# Altium schematic sheet PWR_MCU.SchDoc
size 420 x 297 mm; Address1: Address1; Address2: Address2; Address3: Address3; Address4: Address4; DocumentNumber: АБВГ.123456.001 Э3; SheetNumber: 1; SheetTotal: 3; Scale: 1:1; DocumentType: Схема электрическая принципиальная; FirstReferrence: АБВГ.123456.001
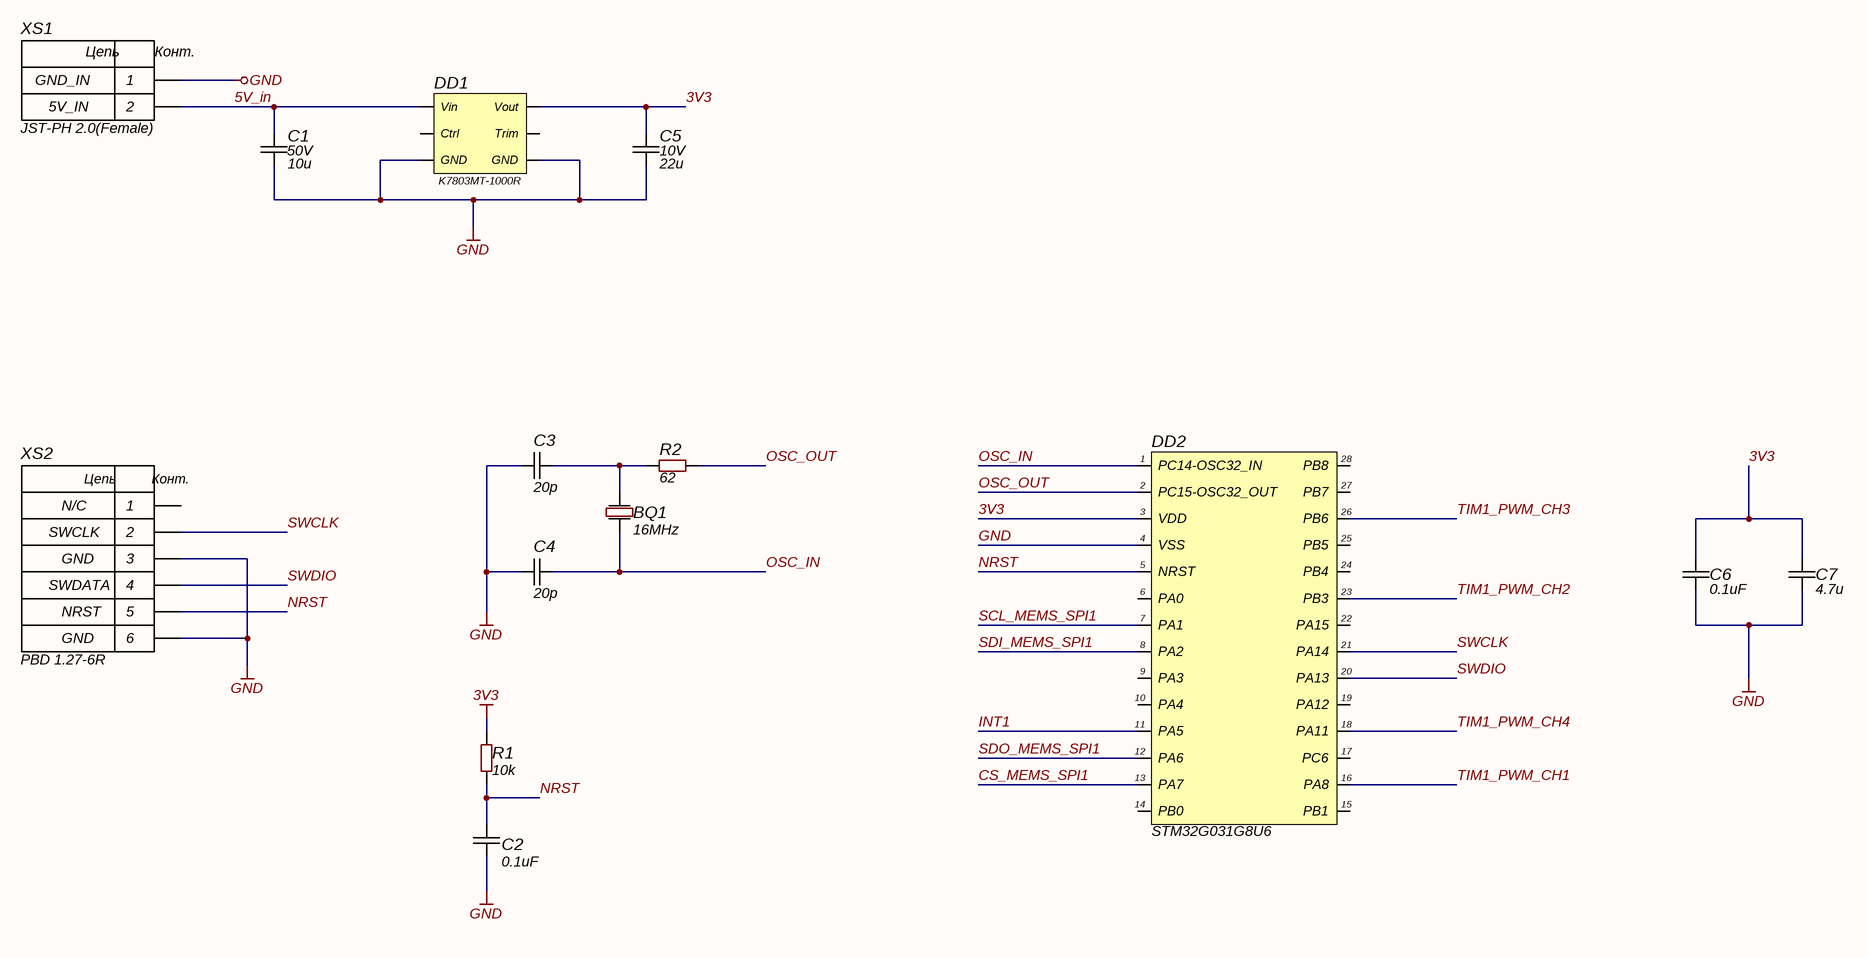
[diagram p0: PWR_MCU.SchDoc]

## Parts
BQ1  Frequency: 16MHz  [OSC: 3225]  (hidden comment: SMD3225-16.000MHz)
C1  value 10u  Voltage: 50V  [CAP: 1206]
C2  value 0.1uF  [CAP: 0603]
C3  value 20p  [CAP: 0603]  (hidden comment: 0603   20 пФ ± 10 % X7R 10В)
C4  value 20p  [CAP: 0603]  (hidden comment: 0603   20 пФ ± 10 % X7R 10В)
C5  value 22u  Voltage: 10V  [CAP: 0603]  (hidden comment: 0603   1 мкФ ± 10 % X7R 16В)
C6  value 0.1uF  [CAP: 0603]
C7  value 4.7u  [CAP: 0603]
DD1  K7803MT-1000R  [DFN_K7805]
DD2  STM32G031G8U6  [28-UFQFPN]
R1  value 10k  [RES: 0603]
R2  value 62  [RES: 0603]  (hidden comment: 0603 62 Ом ± 5 %)
XS1  JST-PH 2.0(Female)  [JST-PH 2.0(Female)]
XS2  PBD 1.27-6R  [CON: PLLD-6R(1.27)]

## Nets
3V3: C5.2 C6.2 C7.2 DD1.3(Vout) DD2.3(VDD) R1.2
GND: C1.1 C2.1 C3.2 C4.2 C5.1 C6.1 C7.1 DD1.2(GND) DD1.5(GND) DD2.4(VSS) XS1.1 XS2.3 XS2.6
5V_in: C1.2 DD1.1(Vin) XS1.2
CS_MEMS_SPI1: DD2.13(PA7)
INT1: DD2.11(PA5)
NRST: C2.2 DD2.5(NRST) R1.1 XS2.5
OSC_IN: BQ1.1 C4.1 DD2.1(PC14-OSC32_IN)
OSC_OUT: DD2.2(PC15-OSC32_OUT) R2.1
SCL_MEMS_SPI1: DD2.7(PA1)
SDI_MEMS_SPI1: DD2.8(PA2)
SDO_MEMS_SPI1: DD2.12(PA6)
SWCLK: DD2.21(PA14) XS2.2
SWDIO: DD2.20(PA13) XS2.4
TIM1_PWM_CH1: DD2.16(PA8)
TIM1_PWM_CH2: DD2.23(PB3)
TIM1_PWM_CH3: DD2.26(PB6)
TIM1_PWM_CH4: DD2.18(PA11)
NetBQ1_3: BQ1.3 C3.1 R2.2

Not connected (* = marked no-connect by the designer): DD1 4(Trim) 6(Ctrl); DD2 6(PA0) 9(PA3) 10(PA4) 14(PB0) 15(PB1) 17(PC6) 19(PA12) 22(PA15) 24(PB4) 25(PB5) 27(PB7) 28(PB8); XS2 1

## Notes on the sheet
- GND_IN
- 5V_IN
- SWCLK
- N/C
- GND
- SWDATA
- NRST
- Перв. примен.
- Справ. №
- Подп. и дата
- Инв. № дубл.
- Взам. инв. №
- Разраб.
- Изм.
- Лист
- № докум.
- Подп.
- Дата
- Лит.
- Масса
- Масштаб
- Пров.
- Т.контр.
- Листов
- Инв. № подл.
- Утв.
- Н.контр.
- 2.106-A3
- Копировал
- Формат А3
- (in symbol JST-PH 2.0(Female)) Цепь; Конт.
- (in symbol PBD 1.27-6R) Цепь; Конт.

## Library data of the parts
BQ1 = Crystal_3225: Resonator; Manufacturer: Diodes Incorporated; PartNumber: FL1000002; ValueManufacturerPartNumber: Crystal, 16MHz, 12pF, ±25ppm, case 3225, -40...+85°C; LoadCapacitance: 12pF; Tolerance: ±25ppm; Package: case 3225; HelpURL: https://www.digikey.com/product-detail/en/diodes-incorporated/FL1000002/FL1000002CT-ND/6042078; Temperature: -40...+85°C; TypeOscilator: Crystal
C1 = Ceramic_1206: Manufacturer: Yageo; PartNumber: CC1206KRX7R9BB104; ValueManufacturerPartNumber: Ceramic capacitor, 10u, X7R, ±10%, 50V, 1206, -55...+125°C; TypeCapacitor: Ceramic capacitor; Tolerance: ±10%; TypeDielectric: X7R; Package: 1206; HelpURL: https://www.digikey.com/product-detail/en/yageo/CC1206KRX7R9BB104/311-1179-1-ND/303089; Temperature: -55...+125°C
C2 C6 = Ceramic_0603: Manufacturer: Yageo; PartNumber: CC0603KRX7R7BB104; ValueManufacturerPartNumber: Ceramic capacitor, 0.1uF, X7R, ±10%, 16V, 0603, -55...+125°C; TypeCapacitor: Ceramic capacitor; Tolerance: ±10%; TypeDielectric: X7R; Voltage: 16V; Package: 0603; HelpURL: https://www.digikey.com/product-detail/en/yageo/CC0603KRX7R7BB104/311-1088-1-ND/302998; Temperature: -55...+125°C
C3 C4 = Ceramic_0603: Capacitor; Manufacturer: Yageo; PartNumber: CC0603KRX7R7BB104; ValueManufacturerPartNumber: Ceramic capacitor, 20p, X7R, ±10%, 16V, 0603, -55...+125°C; TypeCapacitor: Ceramic capacitor; Tolerance: ±10%; Voltage: 16V; Package: 0603; HelpURL: https://www.digikey.com/product-detail/en/yageo/CC0603KRX7R7BB104/311-1088-1-ND/302998; Temperature: -55...+125°C; TypeDielectric: X7R
C5 = Ceramic_0603: Capacitor; Manufacturer: Yageo; PartNumber: CC0603KRX7R7BB104; ValueManufacturerPartNumber: Ceramic capacitor, 22u, X7R, ±10%, 10V, 0603, -55...+125°C; TypeCapacitor: Ceramic capacitor; Tolerance: ±10%; Package: 0603; HelpURL: https://www.digikey.com/product-detail/en/yageo/CC0603KRX7R7BB104/311-1088-1-ND/302998; Temperature: -55...+125°C; TypeDielectric: X7R
C7 = Ceramic_0603: Manufacturer: Yageo; PartNumber: CC0603KRX7R7BB104; ValueManufacturerPartNumber: Ceramic capacitor, 4.7u, X7R, ±10%, 16V, 0603, -55...+125°C; TypeCapacitor: Ceramic capacitor; Tolerance: ±10%; TypeDielectric: X7R; Voltage: 16V; Package: 0603; HelpURL: https://www.digikey.com/product-detail/en/yageo/CC0603KRX7R7BB104/311-1088-1-ND/302998; Temperature: -55...+125°C
DD1 = K7805MT-500R: DC/DC converter; ComponentLink1Description: Datasheet; ComponentLink1URL: https://www.mornsun-power.com/html/pdf/K7805MT-500R4.html
DD2 = STM32G031G8U6: Cortex-M0+; ComponentLink1Description: Documentation; ComponentLink1URL: https://www.st.com/en/microcontrollers-microprocessors/stm32g031g8.html
R1 = Resistor_0603: Manufacturer: Yageo; PartNumber: RC0603JR-07100RL; TypeResistor: Resistor film; Power: 0.1W; Package: 0603; HelpURL: https://www.digikey.com/product-detail/en/yageo/RC0603JR-07100RL/311-100GRCT-ND/729644; ValueManufacturerPartNumber: =TypeResistor+', '+Value+', '+Tolerance+', '+Package+', '+Power+', '+Temperature; Temperature: -55...+125°C
R2 = Resistor_0603: Resistor; Manufacturer: Yageo; PartNumber: RC0603JR-07100RL; ValueManufacturerPartNumber: Resistor film, 62, ±5%, 0603, 0.1W, -55...+125°C; TypeResistor: Resistor film; Power: 0.1W; Tolerance: ±5%; Package: 0603; HelpURL: https://www.digikey.com/product-detail/en/yageo/RC0603JR-07100RL/311-100GRCT-ND/729644; Temperature: -55...+125°C
XS2 = PBD 1.27-6R: DS1065-14-2X3S8BR